# EAGLE design ampelsteuerungeagle (EAGLE 6.5.0)
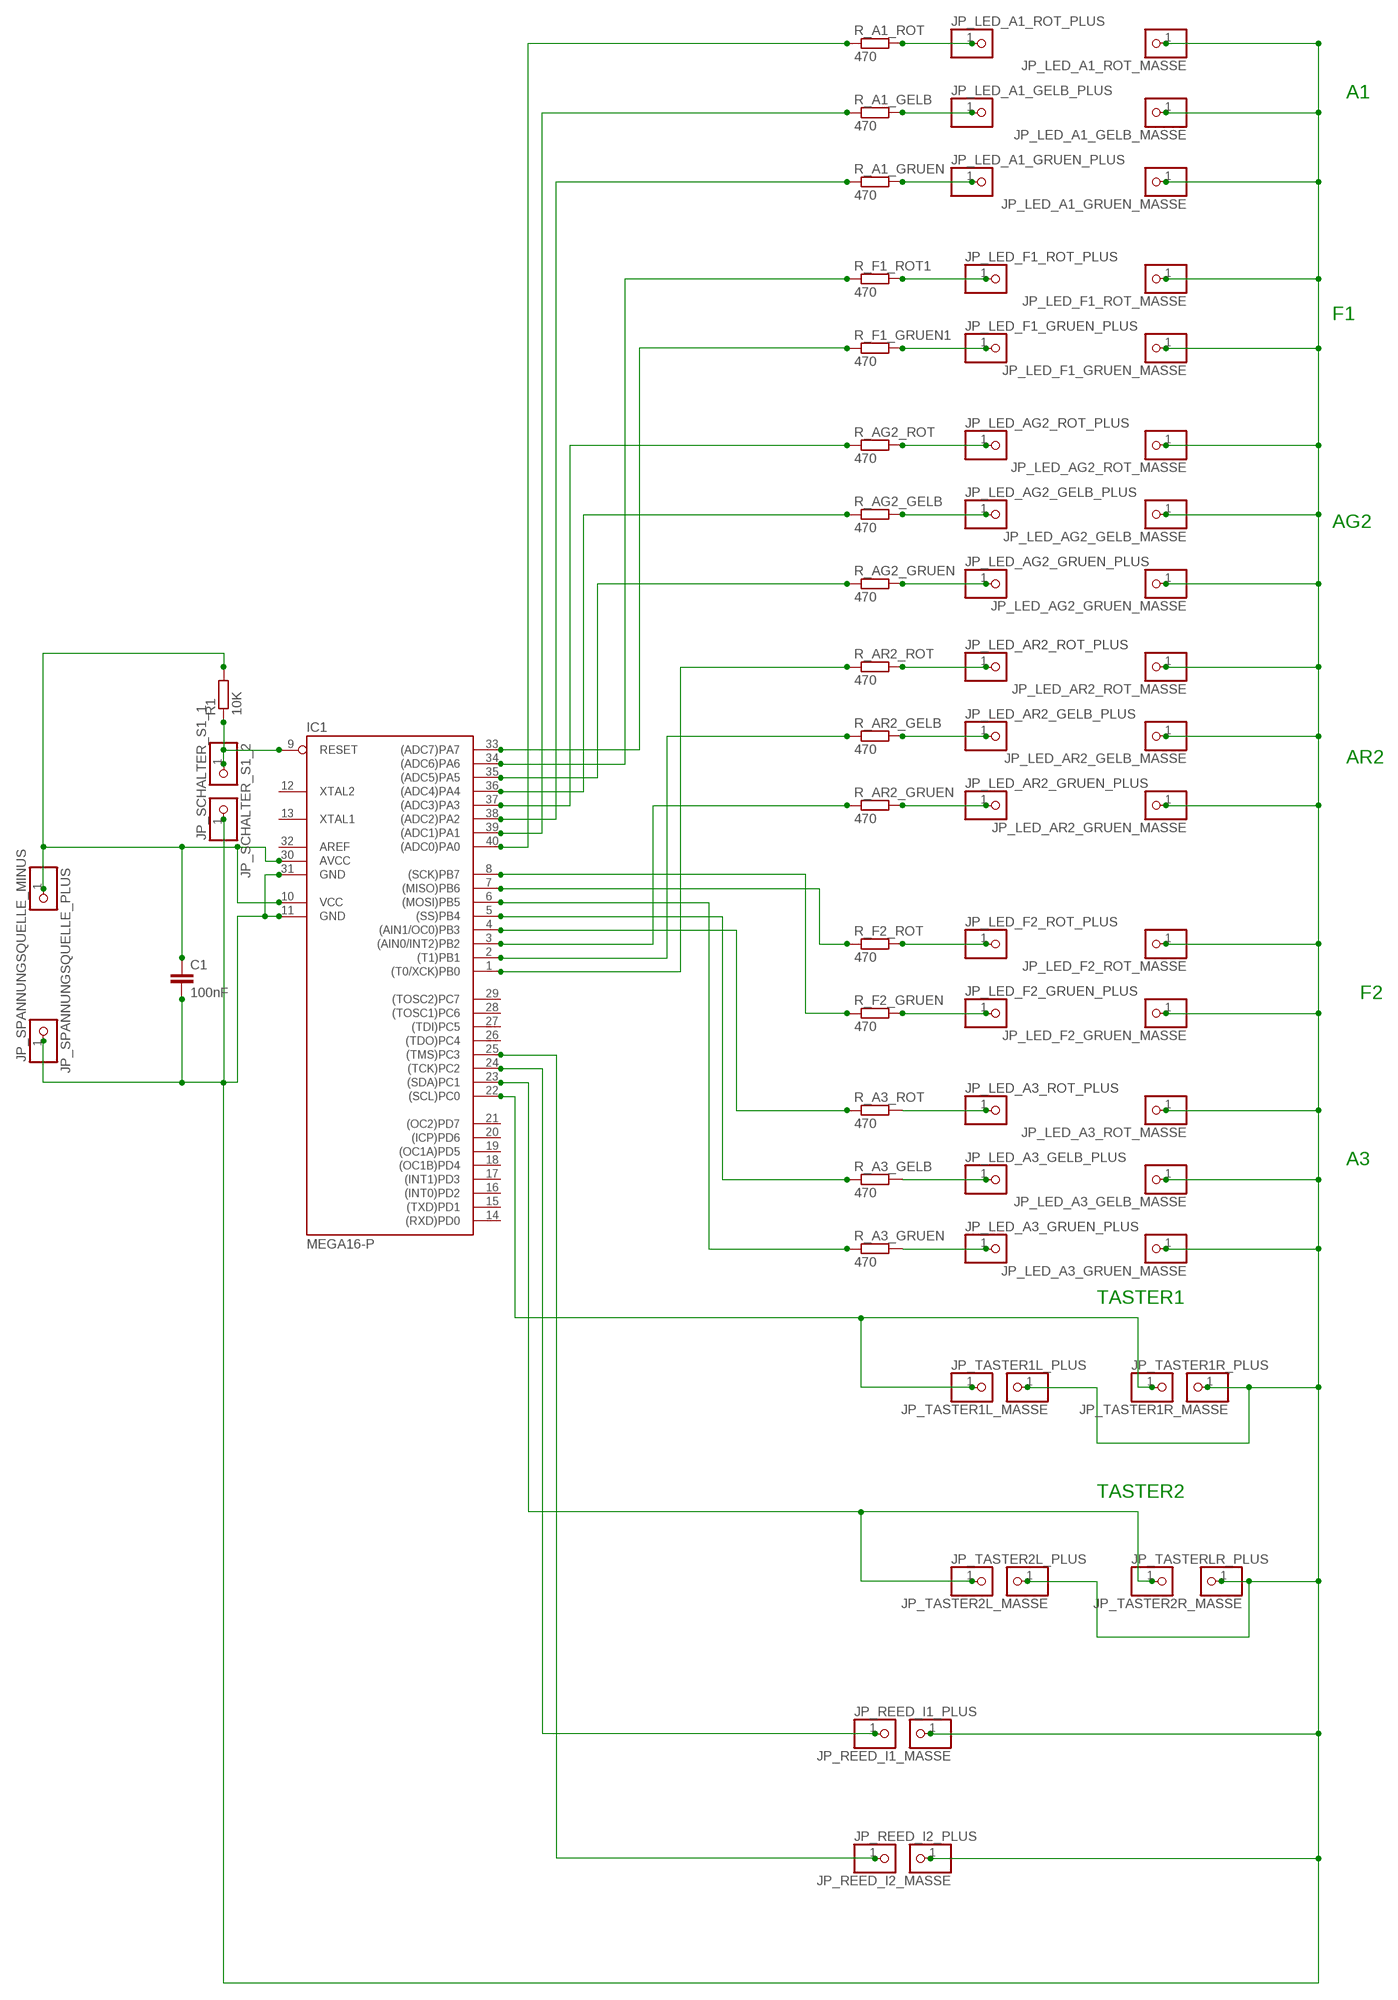
[diagram p0: schematic, sheet 1]

## Parts
C1  100nF  C-EU025-024X044  [C025-024X044]
IC1  MEGA16-P  [DIL40]
JP_LED_A1_GELB_MASSE  PINHD-1X1  [1X01]
JP_LED_A1_GELB_PLUS  PINHD-1X1  [1X01]
JP_LED_A1_GRUEN_MASSE  PINHD-1X1  [1X01]
JP_LED_A1_GRUEN_PLUS  PINHD-1X1  [1X01]
JP_LED_A1_ROT_MASSE  PINHD-1X1  [1X01]
JP_LED_A1_ROT_PLUS  PINHD-1X1  [1X01]
JP_LED_A3_GELB_MASSE  PINHD-1X1  [1X01]
JP_LED_A3_GELB_PLUS  PINHD-1X1  [1X01]
JP_LED_A3_GRUEN_MASSE  PINHD-1X1  [1X01]
JP_LED_A3_GRUEN_PLUS  PINHD-1X1  [1X01]
JP_LED_A3_ROT_MASSE  PINHD-1X1  [1X01]
JP_LED_A3_ROT_PLUS  PINHD-1X1  [1X01]
JP_LED_AG2_GELB_MASSE  PINHD-1X1  [1X01]
JP_LED_AG2_GELB_PLUS  PINHD-1X1  [1X01]
JP_LED_AG2_GRUEN_MASSE  PINHD-1X1  [1X01]
JP_LED_AG2_GRUEN_PLUS  PINHD-1X1  [1X01]
JP_LED_AG2_ROT_MASSE  PINHD-1X1  [1X01]
JP_LED_AG2_ROT_PLUS  PINHD-1X1  [1X01]
JP_LED_AR2_GELB_MASSE  PINHD-1X1  [1X01]
JP_LED_AR2_GELB_PLUS  PINHD-1X1  [1X01]
JP_LED_AR2_GRUEN_MASSE  PINHD-1X1  [1X01]
JP_LED_AR2_GRUEN_PLUS  PINHD-1X1  [1X01]
JP_LED_AR2_ROT_MASSE  PINHD-1X1  [1X01]
JP_LED_AR2_ROT_PLUS  PINHD-1X1  [1X01]
JP_LED_F1_GRUEN_MASSE  PINHD-1X1  [1X01]
JP_LED_F1_GRUEN_PLUS  PINHD-1X1  [1X01]
JP_LED_F1_ROT_MASSE  PINHD-1X1  [1X01]
JP_LED_F1_ROT_PLUS  PINHD-1X1  [1X01]
JP_LED_F2_GRUEN_MASSE  PINHD-1X1  [1X01]
JP_LED_F2_GRUEN_PLUS  PINHD-1X1  [1X01]
JP_LED_F2_ROT_MASSE  PINHD-1X1  [1X01]
JP_LED_F2_ROT_PLUS  PINHD-1X1  [1X01]
JP_REED_I1_MASSE  PINHD-1X1  [1X01]
JP_REED_I1_PLUS  PINHD-1X1  [1X01]
JP_REED_I2_MASSE  PINHD-1X1  [1X01]
JP_REED_I2_PLUS  PINHD-1X1  [1X01]
JP_SCHALTER_S1_1  PINHD-1X1  [1X01]
JP_SCHALTER_S1_2  PINHD-1X1  [1X01]
JP_SPANNUNGSQUELLE_MINUS  PINHD-1X1  [1X01]
JP_SPANNUNGSQUELLE_PLUS  PINHD-1X1  [1X01]
JP_TASTER1L_MASSE  PINHD-1X1  [1X01]
JP_TASTER1L_PLUS  PINHD-1X1  [1X01]
JP_TASTER1R_MASSE  PINHD-1X1  [1X01]
JP_TASTER1R_PLUS  PINHD-1X1  [1X01]
JP_TASTER2L_MASSE  PINHD-1X1  [1X01]
JP_TASTER2L_PLUS  PINHD-1X1  [1X01]
JP_TASTER2R_MASSE  PINHD-1X1  [1X01]
JP_TASTERLR_PLUS  PINHD-1X1  [1X01]
R1  10K  R-EU_0204/2V  [0204V]
R_A1_GELB  470  R-EU_0204/7  [0204/7]
R_A1_GRUEN  470  R-EU_0204/7  [0204/7]
R_A1_ROT  470  R-EU_0204/7  [0204/7]
R_A3_GELB  470  R-EU_0204/7  [0204/7]
R_A3_GRUEN  470  R-EU_0204/7  [0204/7]
R_A3_ROT  470  R-EU_0204/7  [0204/7]
R_AG2_GELB  470  R-EU_0204/7  [0204/7]
R_AG2_GRUEN  470  R-EU_0204/7  [0204/7]
R_AG2_ROT  470  R-EU_0204/7  [0204/7]
R_AR2_GELB  470  R-EU_0204/7  [0204/7]
R_AR2_GRUEN  470  R-EU_0204/7  [0204/7]
R_AR2_ROT  470  R-EU_0204/7  [0204/7]
R_F1_GRUEN1  470  R-EU_0204/7  [0204/7]
R_F1_ROT1  470  R-EU_0204/7  [0204/7]
R_F2_GRUEN  470  R-EU_0204/7  [0204/7]
R_F2_ROT  470  R-EU_0204/7  [0204/7]

## Nets
N$1: C1.1 IC1.10(VCC) IC1.30(AVCC) JP_SPANNUNGSQUELLE_PLUS.1 R1.2
N$2: IC1.22((SCL)PC0) JP_TASTER1L_PLUS.1 JP_TASTER1R_PLUS.1
N$4: IC1.40((ADC0)PA0) R_A1_ROT.1
N$5: IC1.39((ADC1)PA1) R_A1_GELB.1
N$6: IC1.38((ADC2)PA2) R_A1_GRUEN.1
N$7: IC1.37((ADC3)PA3) R_AG2_ROT.1
N$8: IC1.36((ADC4)PA4) R_AG2_GELB.1
N$9: IC1.35((ADC5)PA5) R_AG2_GRUEN.1
N$10: IC1.34((ADC6)PA6) R_F1_ROT1.1
N$11: IC1.33((ADC7)PA7) R_F1_GRUEN1.1
N$12: IC1.1((T0/XCK)PB0) R_AR2_ROT.1
N$13: IC1.2((T1)PB1) R_AR2_GELB.1
N$14: IC1.3((AIN0/INT2)PB2) R_AR2_GRUEN.1
N$15: IC1.4((AIN1/OC0)PB3) R_A3_ROT.1
N$16: IC1.5((SS)PB4) R_A3_GELB.1
N$17: IC1.6((MOSI)PB5) R_A3_GRUEN.1
N$18: IC1.7((MISO)PB6) R_F2_ROT.1
N$19: JP_LED_AR2_GRUEN_PLUS.1 R_AR2_GRUEN.2
N$20: JP_LED_A3_ROT_PLUS.1 R_A3_ROT.2
N$21: JP_LED_AR2_GELB_PLUS.1 R_AR2_GELB.2
N$22: JP_LED_AR2_ROT_PLUS.1 R_AR2_ROT.2
N$23: JP_LED_AG2_GRUEN_PLUS.1 R_AG2_GRUEN.2
N$24: JP_LED_AG2_GELB_PLUS.1 R_AG2_GELB.2
N$25: JP_LED_AG2_ROT_PLUS.1 R_AG2_ROT.2
N$26: JP_LED_A1_GRUEN_PLUS.1 R_A1_GRUEN.2
N$27: JP_LED_A1_GELB_PLUS.1 R_A1_GELB.2
N$28: JP_LED_A1_ROT_PLUS.1 R_A1_ROT.2
N$29: JP_LED_F1_ROT_PLUS.1 R_F1_ROT1.2
N$30: JP_LED_F1_GRUEN_PLUS.1 R_F1_GRUEN1.2
N$31: JP_LED_F2_ROT_PLUS.1 R_F2_ROT.2
N$32: JP_LED_F2_GRUEN_PLUS.1 R_F2_GRUEN.2
N$33: JP_LED_A3_GELB_PLUS.1 R_A3_GELB.2
N$34: JP_LED_A3_GRUEN_PLUS.1 R_A3_GRUEN.2
N$35: IC1.9(RESET) JP_SCHALTER_S1_2.1 R1.1
N$36: IC1.23((SDA)PC1) JP_TASTER2L_PLUS.1 JP_TASTERLR_PLUS.1
N$37: IC1.24((TCK)PC2) JP_REED_I1_PLUS.1
N$38: C1.2 IC1.11(GND) IC1.31(GND) JP_LED_A1_GELB_MASSE.1 JP_LED_A1_GRUEN_MASSE.1 JP_LED_A1_ROT_MASSE.1 JP_LED_A3_GELB_MASSE.1 JP_LED_A3_GRUEN_MASSE.1 JP_LED_A3_ROT_MASSE.1 JP_LED_AG2_GELB_MASSE.1 JP_LED_AG2_GRUEN_MASSE.1 JP_LED_AG2_ROT_MASSE.1 JP_LED_AR2_GELB_MASSE.1 JP_LED_AR2_GRUEN_MASSE.1 JP_LED_AR2_ROT_MASSE.1 JP_LED_F1_GRUEN_MASSE.1 JP_LED_F1_ROT_MASSE.1 JP_LED_F2_GRUEN_MASSE.1 JP_LED_F2_ROT_MASSE.1 JP_REED_I1_MASSE.1 JP_REED_I2_MASSE.1 JP_SCHALTER_S1_1.1 JP_SPANNUNGSQUELLE_MINUS.1 JP_TASTER1L_MASSE.1 JP_TASTER1R_MASSE.1 JP_TASTER2L_MASSE.1 JP_TASTER2R_MASSE.1
N$39: IC1.25((TMS)PC3) JP_REED_I2_PLUS.1
N$40: IC1.8((SCK)PB7) R_F2_GRUEN.1
Unconnected: IC1.12(XTAL2) IC1.13(XTAL1) IC1.14((RXD)PD0) IC1.15((TXD)PD1) IC1.16((INT0)PD2) IC1.17((INT1)PD3) IC1.18((OC1B)PD4) IC1.19((OC1A)PD5) IC1.20((ICP)PD6) IC1.21((OC2)PD7) IC1.26((TDO)PC4) IC1.27((TDI)PC5) IC1.28((TOSC1)PC6) IC1.29((TOSC2)PC7) IC1.32(AREF)

## Notes on the sheet
- A1
- F1
- AG2
- AR2
- F2
- A3
- TASTER1
- TASTER2

## Library data of the parts
C1 = rcl:C-EU: CAPACITOR, European symbol
IC1 = atmel:MEGA16-P: MICROCONTROLLER 16 Kbytes FLASH 1 kbytes SRAM 512 bytes EEPROM USART 8-channel 10 bit ADC Source: avr.lbr; MPN: ATMEGA16-16PU; OC_FARNELL: 9171142; OC_NEWARK: 01M6885
JP_LED_A1_GELB_MASSE JP_LED_A1_GELB_PLUS JP_LED_A1_GRUEN_MASSE JP_LED_A1_GRUEN_PLUS JP_LED_A1_ROT_MASSE JP_LED_A1_ROT_PLUS JP_LED_A3_GELB_MASSE JP_LED_A3_GELB_PLUS JP_LED_A3_GRUEN_MASSE JP_LED_A3_GRUEN_PLUS JP_LED_A3_ROT_MASSE JP_LED_A3_ROT_PLUS JP_LED_AG2_GELB_MASSE JP_LED_AG2_GELB_PLUS JP_LED_AG2_GRUEN_MASSE JP_LED_AG2_GRUEN_PLUS JP_LED_AG2_ROT_MASSE JP_LED_AG2_ROT_PLUS JP_LED_AR2_GELB_MASSE JP_LED_AR2_GELB_PLUS JP_LED_AR2_GRUEN_MASSE JP_LED_AR2_GRUEN_PLUS JP_LED_AR2_ROT_MASSE JP_LED_AR2_ROT_PLUS JP_LED_F1_GRUEN_MASSE JP_LED_F1_GRUEN_PLUS JP_LED_F1_ROT_MASSE JP_LED_F1_ROT_PLUS JP_LED_F2_GRUEN_MASSE JP_LED_F2_GRUEN_PLUS JP_LED_F2_ROT_MASSE JP_LED_F2_ROT_PLUS JP_REED_I1_MASSE JP_REED_I1_PLUS JP_REED_I2_MASSE JP_REED_I2_PLUS JP_SCHALTER_S1_1 JP_SCHALTER_S1_2 JP_SPANNUNGSQUELLE_MINUS JP_SPANNUNGSQUELLE_PLUS JP_TASTER1L_MASSE JP_TASTER1L_PLUS JP_TASTER1R_MASSE JP_TASTER1R_PLUS JP_TASTER2L_MASSE JP_TASTER2L_PLUS JP_TASTER2R_MASSE JP_TASTERLR_PLUS = pinhead:PINHD-1X1: PIN HEADER
R1 R_A1_GELB R_A1_GRUEN R_A1_ROT R_A3_GELB R_A3_GRUEN R_A3_ROT R_AG2_GELB R_AG2_GRUEN R_AG2_ROT R_AR2_GELB R_AR2_GRUEN R_AR2_ROT R_F1_GRUEN1 R_F1_ROT1 R_F2_GRUEN R_F2_ROT = resistor:R-EU_: RESISTOR, European symbol

## Board
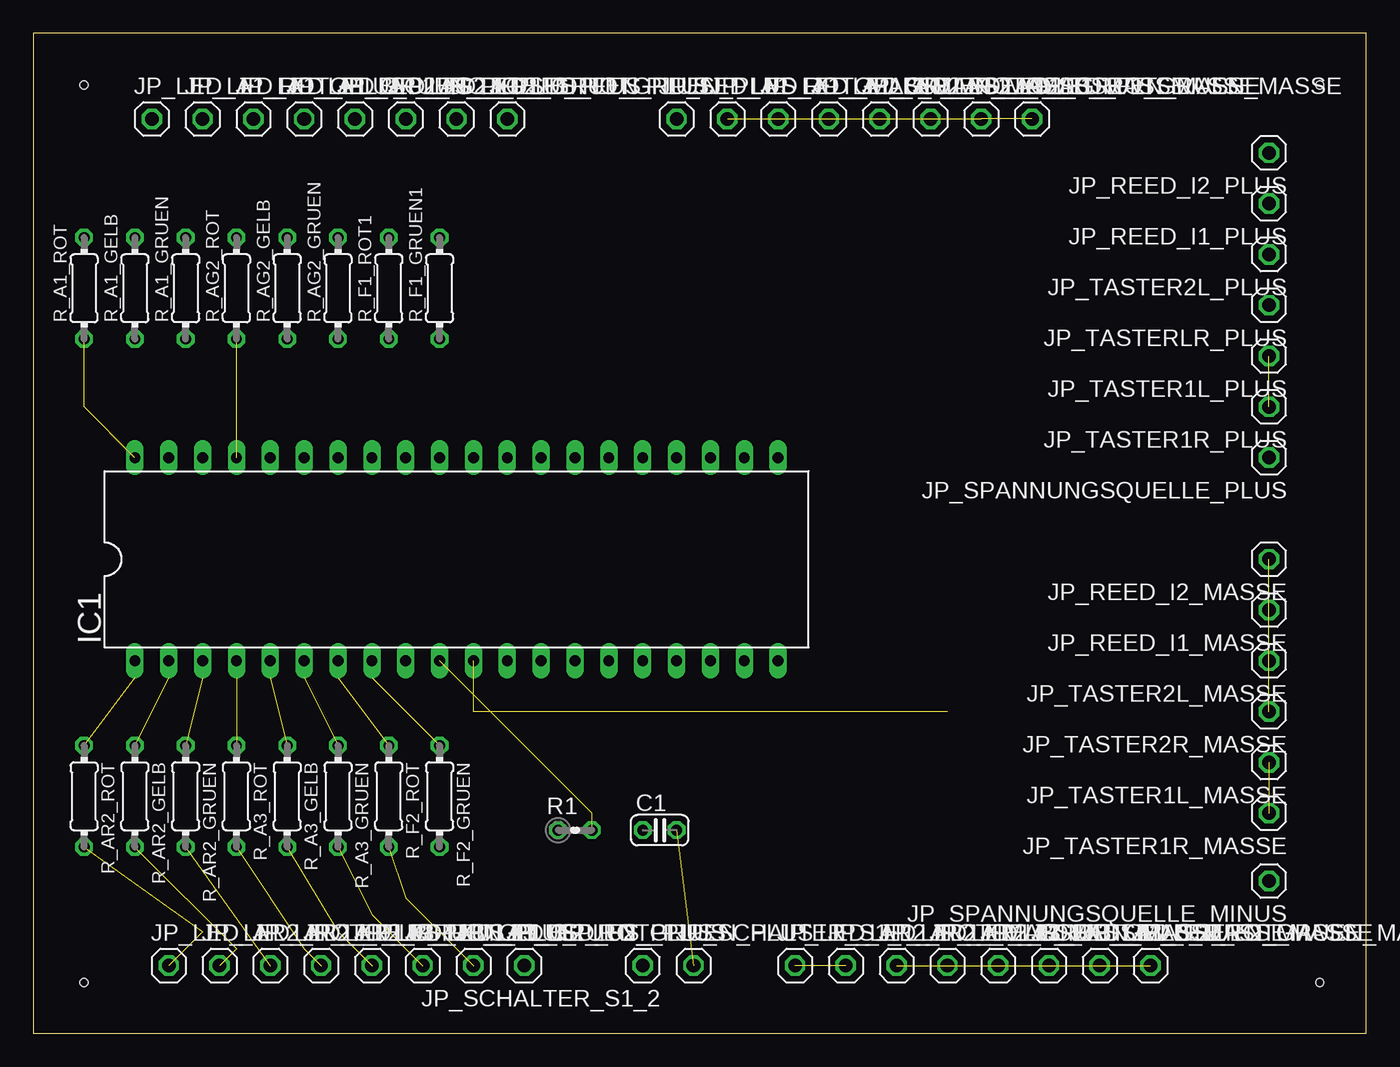
[diagram p1: board, top side]
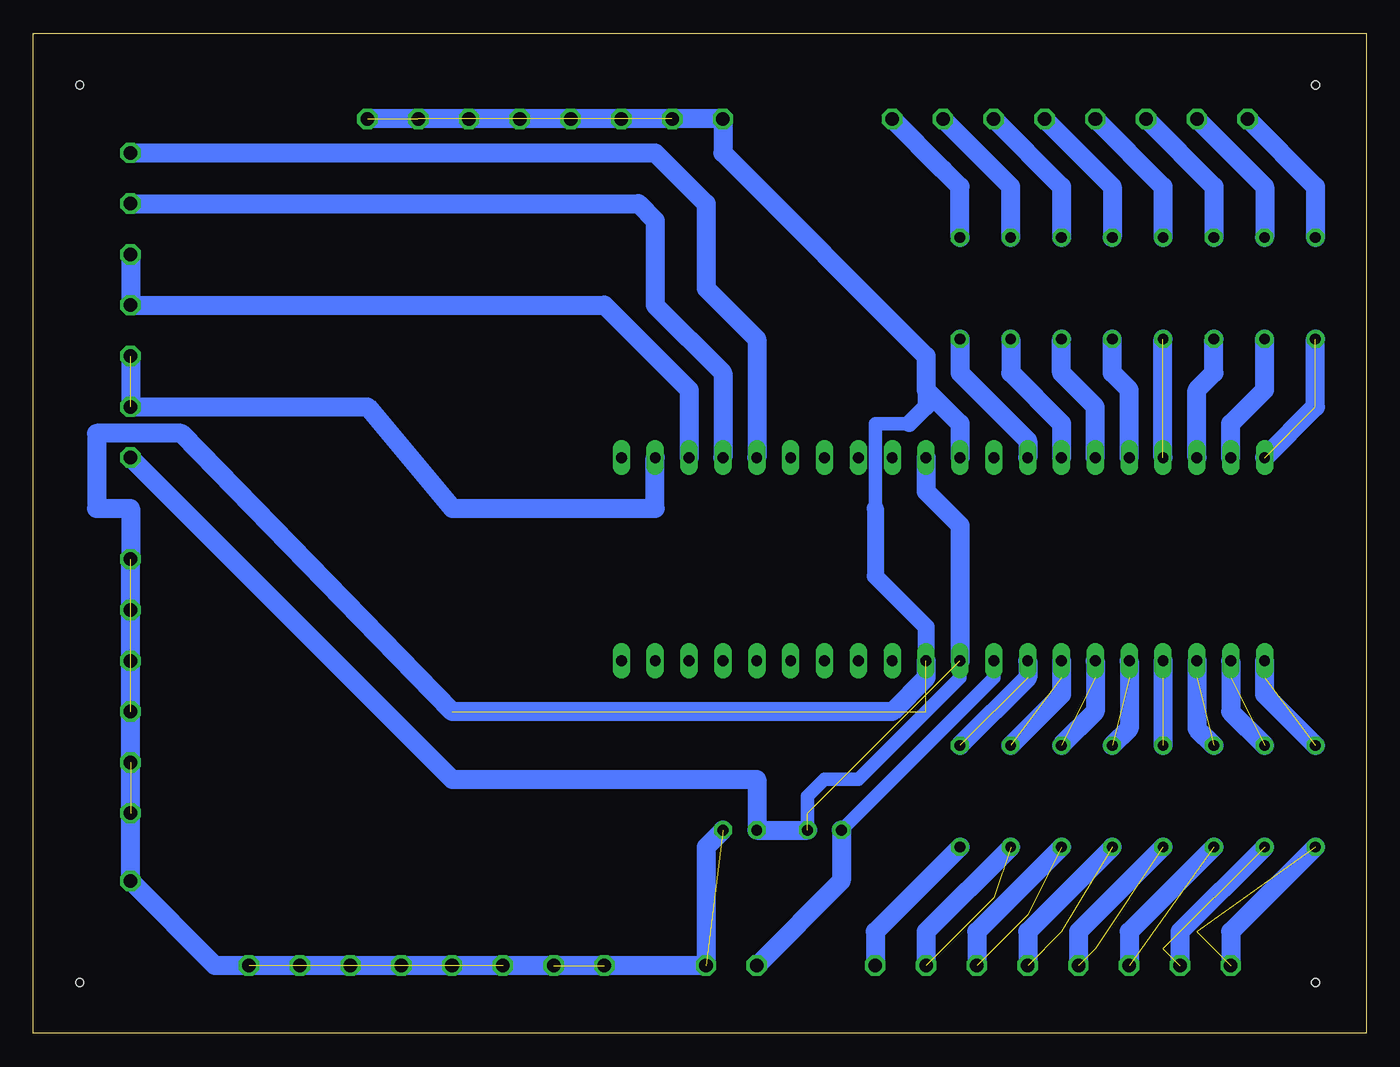
[diagram p2: board, bottom side, seen from below]

Size 100 x 75 mm. Coordinates in mm from the lower left corner, seen from the top.
Outline: 0,0 100,0 100,75 0,75 0,0
Copper layers (1*16): Top 0.035mm / dielectric 1.5mm / Bottom 0.035mm
Design rules "default": minimum track width 10mil, minimum drill 24mil, track to track 8mil, track to pad 8mil, pad to pad 8mil, via to via 8mil, smd to smd 8mil, copper to edge 40mil, drill to drill 8mil, minimum pad ring 10mil, minimum via ring 8mil, stop-mask expansion 4mil, vias tented up to drill 0mil, thermal gap 10mil
Holes 0.6 mm at 3.81,71.12 3.81,3.81 96.52,3.81 96.52,71.12

### Footprints (pad centres in the part's own frame; a part is rotated, then mirrored left to right if it is on the bottom)
C025-024X044 = drill 0.813 octagon: 1 -1.27,0; 2 1.27,0
DIL40 = drill 0.813 long: 1 -24.13,-7.62; 2 -21.59,-7.62; 3 -19.05,-7.62; 4 -16.51,-7.62; 5 -13.97,-7.62; 6 -11.43,-7.62; 7 -8.89,-7.62; 8 -6.35,-7.62; 9 -3.81,-7.62; 10 -1.27,-7.62; 11 1.27,-7.62; 12 3.81,-7.62; 13 6.35,-7.62; 14 8.89,-7.62; 15 11.43,-7.62; 16 13.97,-7.62; 17 16.51,-7.62; 18 19.05,-7.62; 19 21.59,-7.62; 20 24.13,-7.62; 21 24.13,7.62; 22 21.59,7.62; 23 19.05,7.62; 24 16.51,7.62; 25 13.97,7.62; 26 11.43,7.62; 27 8.89,7.62; 28 6.35,7.62; 29 3.81,7.62; 30 1.27,7.62; 31 -1.27,7.62; 32 -3.81,7.62; 33 -6.35,7.62; 34 -8.89,7.62; 35 -11.43,7.62; 36 -13.97,7.62; 37 -16.51,7.62; 38 -19.05,7.62; 39 -21.59,7.62; 40 -24.13,7.62
1X01 = drill 1.016 octagon: 1 0,0
0204V = drill 0.813 octagon: 1 -1.27,0; 2 1.27,0
0204/7 = drill 0.813 octagon: 1 -3.81,0; 2 3.81,0

### Placement (x,y rotation side)
C1  46.99,15.24 0 top
IC1  31.75,35.56 0 top
JP_LED_A1_GELB_MASSE  52.07,68.58 0 top
JP_LED_A1_GELB_PLUS  12.7,68.58 0 top
JP_LED_A1_GRUEN_MASSE  55.88,68.58 0 top
JP_LED_A1_GRUEN_PLUS  16.51,68.58 0 top
JP_LED_A1_ROT_MASSE  48.26,68.58 0 top
JP_LED_A1_ROT_PLUS  8.89,68.58 0 top
JP_LED_A3_GELB_MASSE  72.39,5.08 0 top
JP_LED_A3_GELB_PLUS  25.4,5.08 0 top
JP_LED_A3_GRUEN_MASSE  76.2,5.08 0 top
JP_LED_A3_GRUEN_PLUS  29.21,5.08 0 top
JP_LED_A3_ROT_MASSE  68.58,5.08 0 top
JP_LED_A3_ROT_PLUS  21.59,5.08 0 top
JP_LED_AG2_GELB_MASSE  63.5,68.58 0 top
JP_LED_AG2_GELB_PLUS  24.13,68.58 0 top
JP_LED_AG2_GRUEN_MASSE  67.31,68.58 0 top
JP_LED_AG2_GRUEN_PLUS  27.94,68.58 0 top
JP_LED_AG2_ROT_MASSE  59.69,68.58 0 top
JP_LED_AG2_ROT_PLUS  20.32,68.58 0 top
JP_LED_AR2_GELB_MASSE  60.96,5.08 0 top
JP_LED_AR2_GELB_PLUS  13.97,5.08 0 top
JP_LED_AR2_GRUEN_MASSE  64.77,5.08 0 top
JP_LED_AR2_GRUEN_PLUS  17.78,5.08 0 top
JP_LED_AR2_ROT_MASSE  57.15,5.08 0 top
JP_LED_AR2_ROT_PLUS  10.16,5.08 0 top
JP_LED_F1_GRUEN_MASSE  74.93,68.58 0 top
JP_LED_F1_GRUEN_PLUS  35.56,68.58 0 top
JP_LED_F1_ROT_MASSE  71.12,68.58 0 top
JP_LED_F1_ROT_PLUS  31.75,68.58 0 top
JP_LED_F2_GRUEN_MASSE  83.82,5.08 0 top
JP_LED_F2_GRUEN_PLUS  36.83,5.08 0 top
JP_LED_F2_ROT_MASSE  80.01,5.08 0 top
JP_LED_F2_ROT_PLUS  33.02,5.08 0 top
JP_REED_I1_MASSE  92.71,31.75 180 top
JP_REED_I1_PLUS  92.71,62.23 180 top
JP_REED_I2_MASSE  92.71,35.56 180 top
JP_REED_I2_PLUS  92.71,66.04 180 top
JP_SCHALTER_S1_1  49.53,5.08 0 top
JP_SCHALTER_S1_2  45.72,5.08 180 top
JP_SPANNUNGSQUELLE_MINUS  92.71,11.43 180 top
JP_SPANNUNGSQUELLE_PLUS  92.71,43.18 180 top
JP_TASTER1L_MASSE  92.71,20.32 180 top
JP_TASTER1L_PLUS  92.71,50.8 180 top
JP_TASTER1R_MASSE  92.71,16.51 180 top
JP_TASTER1R_PLUS  92.71,46.99 180 top
JP_TASTER2L_MASSE  92.71,27.94 180 top
JP_TASTER2L_PLUS  92.71,58.42 180 top
JP_TASTER2R_MASSE  92.71,24.13 180 top
JP_TASTERLR_PLUS  92.71,54.61 180 top
R1  40.64,15.24 0 top
R_A1_GELB  7.62,55.88 90 top
R_A1_GRUEN  11.43,55.88 90 top
R_A1_ROT  3.81,55.88 90 top
R_A3_GELB  19.05,17.78 270 top
R_A3_GRUEN  22.86,17.78 270 top
R_A3_ROT  15.24,17.78 270 top
R_AG2_GELB  19.05,55.88 90 top
R_AG2_GRUEN  22.86,55.88 90 top
R_AG2_ROT  15.24,55.88 90 top
R_AR2_GELB  7.62,17.78 270 top
R_AR2_GRUEN  11.43,17.78 270 top
R_AR2_ROT  3.81,17.78 270 top
R_F1_GRUEN1  30.48,55.88 90 top
R_F1_ROT1  26.67,55.88 90 top
R_F2_GRUEN  30.48,17.78 270 top
R_F2_ROT  26.67,17.78 270 top

### Tracks (layer width: path | path; a pad name or v marks a point on that pad's centre or on a via)
N$1  (2 unrouted)
  Bottom 1.016: IC1.10 30.48,26.67 38.1,19.05 40.64,19.05 41.91,17.78 R1.2
  Bottom 1.422: IC1.30 33.02,40.64 30.48,38.1 IC1.10 | JP_SPANNUNGSQUELLE_PLUS.1 68.58,19.05 45.72,19.05 C1.1 R1.2
N$2  (1 unrouted)
  Bottom 1.422: JP_TASTER1L_PLUS.1 JP_TASTER1R_PLUS.1 74.93,46.99 68.58,39.37 53.34,39.37 IC1.22
N$4  (2 unrouted)
  Bottom 1.422: IC1.40 3.81,46.99 R_A1_ROT.1
N$5
  Bottom 1.422: IC1.39 10.16,45.72 7.62,48.26 R_A1_GELB.1
N$6
  Bottom 1.422: IC1.38 12.7,48.26 11.43,49.53 R_A1_GRUEN.1
N$7  (1 unrouted)
  Bottom 1.422: IC1.37 R_AG2_ROT.1
N$8
  Bottom 1.422: IC1.36 17.78,48.26 19.05,49.53 R_AG2_GELB.1
N$9
  Bottom 1.422: IC1.35 20.32,46.99 22.86,49.53 R_AG2_GRUEN.1
N$10
  Bottom 1.422: R_F1_ROT1.1 26.67,49.53 22.86,45.72 IC1.34
N$11
  Bottom 1.422: R_F1_GRUEN1.1 30.48,49.53 25.4,44.45 IC1.33
N$12  (1 unrouted)
  Bottom 0.406: IC1.1 7.62,26.67
  Bottom 1.422: R_AR2_ROT.1 7.62,25.4 IC1.1
N$13  (1 unrouted)
  Bottom 0.406: IC1.2 10.16,26.67
  Bottom 1.422: IC1.2 10.16,24.13 R_AR2_GELB.1
N$14  (1 unrouted)
  Bottom 0.406: IC1.3 12.7,26.67
  Bottom 1.422: IC1.3 12.7,22.86 R_AR2_GRUEN.1
N$15  (1 unrouted)
  Bottom 0.406: IC1.4 15.24,26.67
  Bottom 1.422: IC1.4 R_A3_ROT.1
N$16  (1 unrouted)
  Bottom 0.406: IC1.5 17.78,26.67
  Bottom 1.422: IC1.5 17.78,22.86 R_A3_GELB.1
N$17  (1 unrouted)
  Bottom 0.406: IC1.6 20.32,26.67
  Bottom 1.422: IC1.6 20.32,24.13 R_A3_GRUEN.1
N$18  (1 unrouted)
  Bottom 0.406: IC1.7 22.86,26.67
  Bottom 1.422: IC1.7 22.86,25.4 R_F2_ROT.1
N$19  (1 unrouted)
  Bottom 1.422: R_AR2_GRUEN.2 17.78,7.62 JP_LED_AR2_GRUEN_PLUS.1
N$20  (2 unrouted)
  Bottom 1.422: R_A3_ROT.2 21.59,7.62 JP_LED_A3_ROT_PLUS.1
N$21  (2 unrouted)
  Bottom 1.422: R_AR2_GELB.2 13.97,7.62 JP_LED_AR2_GELB_PLUS.1
N$22  (2 unrouted)
  Bottom 1.422: R_AR2_ROT.2 10.16,7.62 JP_LED_AR2_ROT_PLUS.1
N$23
  Bottom 1.422: JP_LED_AG2_GRUEN_PLUS.1 22.86,63.5 R_AG2_GRUEN.2
N$24
  Bottom 1.422: JP_LED_AG2_GELB_PLUS.1 19.05,63.5 R_AG2_GELB.2
N$25
  Bottom 1.422: JP_LED_AG2_ROT_PLUS.1 15.24,63.5 R_AG2_ROT.2
N$26
  Bottom 1.422: JP_LED_A1_GRUEN_PLUS.1 11.43,63.5 R_A1_GRUEN.2
N$27
  Bottom 1.422: JP_LED_A1_GELB_PLUS.1 7.62,63.5 R_A1_GELB.2
N$28
  Bottom 1.422: JP_LED_A1_ROT_PLUS.1 3.81,63.5 R_A1_ROT.2
N$29
  Bottom 1.422: R_F1_ROT1.2 26.67,63.5 27.94,64.77 JP_LED_F1_ROT_PLUS.1
N$30
  Bottom 1.422: R_F1_GRUEN1.2 30.48,63.5 31.75,64.77 JP_LED_F1_GRUEN_PLUS.1
N$31  (2 unrouted)
  Bottom 1.422: R_F2_ROT.2 33.02,7.62 JP_LED_F2_ROT_PLUS.1
N$32
  Bottom 1.422: R_F2_GRUEN.2 36.83,7.62 JP_LED_F2_GRUEN_PLUS.1
N$33  (2 unrouted)
  Bottom 1.422: R_A3_GELB.2 25.4,7.62 JP_LED_A3_GELB_PLUS.1
N$34  (2 unrouted)
  Bottom 1.422: R_A3_GRUEN.2 29.21,7.62 JP_LED_A3_GRUEN_PLUS.1
N$35
  Bottom 1.016: IC1.9 27.94,26.67 R1.1
  Bottom 1.422: R1.1 39.37,11.43 JP_SCHALTER_S1_2.1
N$36
  Bottom 1.422: JP_TASTER2L_PLUS.1 JP_TASTERLR_PLUS.1 57.15,54.61 50.8,48.26 IC1.23
N$37
  Bottom 1.422: JP_REED_I1_PLUS.1 54.61,62.23 53.34,60.96 53.34,54.61 48.26,49.53 IC1.24
N$38  (19 unrouted)
  Bottom 0.406: JP_LED_F2_GRUEN_MASSE.1 JP_LED_AR2_ROT_MASSE.1 JP_SCHALTER_S1_1.1
  Bottom 1.016: 34.29,45.72 36.83,45.72 36.83,39.37
  Bottom 1.27: 33.02,48.26 33.02,46.99 34.29,45.72 | 36.83,39.37 36.83,34.29 33.02,30.48 IC1.11
  Bottom 1.422: IC1.31 30.48,45.72 33.02,48.26 33.02,50.8 48.26,66.04 JP_LED_A1_ROT_MASSE.1 JP_LED_F1_GRUEN_MASSE.1 | C1.2 49.53,13.97 JP_SCHALTER_S1_1.1 JP_LED_F2_GRUEN_MASSE.1 86.36,5.08 JP_SPANNUNGSQUELLE_MINUS.1 JP_TASTER1R_MASSE.1 JP_REED_I2_MASSE.1 92.71,39.37 95.25,39.37 95.25,45 88.9,45 68.58,24.13 35.56,24.13 33.02,26.67 IC1.11
N$39
  Bottom 1.422: JP_REED_I2_PLUS.1 53.34,66.04 49.53,62.23 49.53,55.88 45.72,52.07 IC1.25
N$40  (1 unrouted)
  Bottom 1.422: IC1.8 25.4,26.67 R_F2_GRUEN.1